# EAGLE design WS2812B-compact_2 (EAGLE 6.6.0)
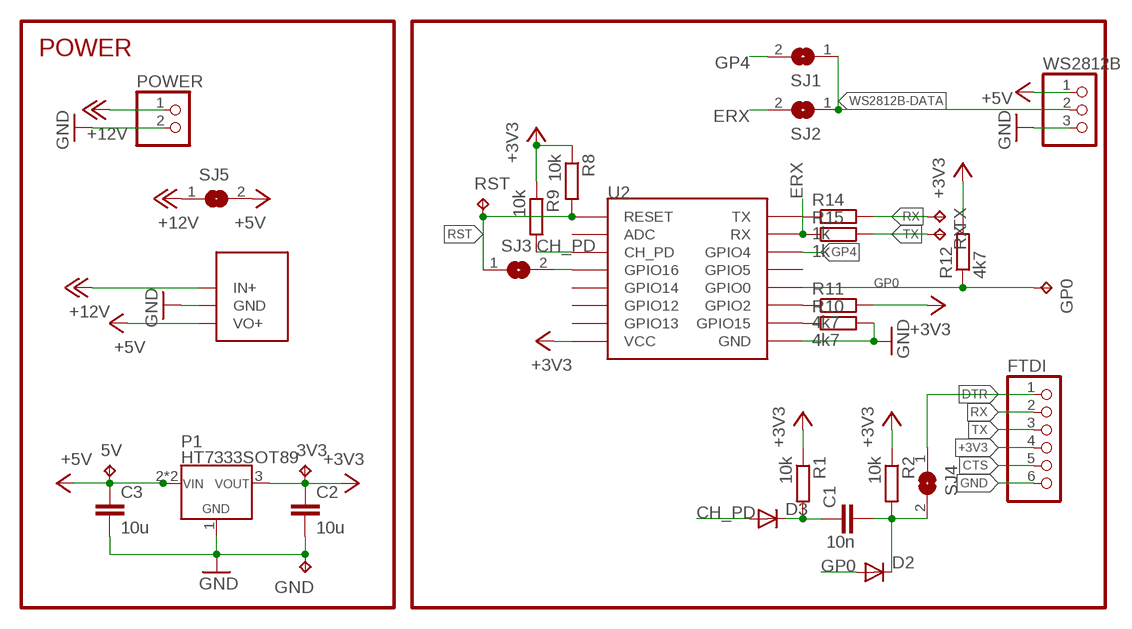
[diagram p0: schematic, sheet 1]

## Parts
3V3  TPB1,27  [B1,27]
5V  TPB1,27  [B1,27]
C1  10n  C-EUC0805  [C0805]
C2  10u  C-EUC0805  [C0805]
C3  10u  C-EUC0805  [C0805]
D2  DIODE-MINIMELF  [MINIMELF]
D3  DIODE-MINIMELF  [MINIMELF]
FTDI  PINHD-1X06_2.54-S  [1X06-S]
GND  TPB1,27  [B1,27]
GP0  TPB1,27  [B1,27]
P1  HT7333SOT89  [SOT89]
POWER  PINHD-1X2  [1X02]
R1  10k  R-EU_R0805  [R0805]
R2  10k  R-EU_R0805  [R0805]
R8  10k  R-EU_R0805  [R0805]
R9  10k  R-EU_R0805  [R0805]
R10  4k7  R-EU_R0805  [R0805]
R11  4k7  R-EU_R0805  [R0805]
R12  4k7  R-EU_R0805  [R0805]
R14  1k  R-EU_R0805  [R0805]
R15  1k  R-EU_R0805  [R0805]
RST  TPB1,27  [B1,27]
RX  TPB1,27  [B1,27]
SJ1  SJ  [SJ]
SJ2  SJ  [SJ]
SJ3  SJ  [SJ]
SJ4  SJ  [SJ]
SJ5  SJ  [SJ]
TX  TPB1,27  [B1,27]
U2  ESP12SMD  [ESP12-SMD]
U$1  BUCK_CONVERTER_TE818_VAR  [BUCK_CONVERTER_TE818_VAR]
WS2812B  PINHD-1X03_2.54-S  [1X03-S]

## Nets
+3V3: 3V3.TP C2.1 FTDI.4 P1.3(VOUT) R1.1 R2.1 R8.1 R9.1 R11.2 R12.2 U2.VCC
+5V: 5V.TP C3.1 P1.2(VIN) P1.2@1(VIN) SJ5.2 U$1.VO+ WS2812B.1
+12V: POWER.1 SJ5.1 U$1.IN+
CH_PD: D3.A R9.2 U2.CH_PD
CTS: FTDI.5
DTR: FTDI.1 SJ4.1
ERX: R15.1 SJ2.2 U2.RXD0(RX)
GND: C2.2 C3.2 FTDI.6 GND.TP P1.1(GND) POWER.2 R10.2 U2.GND U$1.GND WS2812B.3
GP0: D2.A GP0.TP R12.1 U2.GPIO0
GP4: SJ1.2 U2.GPIO4
N$2: C1.2 D2.C R2.2 SJ4.2
N$3: C1.1 D3.C R1.2
N$4: R10.1 U2.GPIO15
N$5: R11.1 U2.GPIO2
N$6: SJ3.2 U2.GPIO16
N$7: R14.1 U2.TXD0(TX)
RST: R8.2 RST.TP SJ3.1 U2.RESET
RX: FTDI.2 R14.2 TX.TP
TX: FTDI.3 R15.2 RX.TP
WS2812B-DATA: SJ1.1 SJ2.1 WS2812B.2
Unconnected: U2.ADC U2.GPIO5 U2.GPIO12 U2.GPIO13 U2.GPIO14

## Notes on the sheet
- POWER

## Library data of the parts
3V3 5V GND GP0 RST RX TX = testpad:TP: Test pad
C1-C3 = rcl:C-EU: CAPACITOR, European symbol
D2 D3 = diode:DIODE-: DIODE
FTDI = pinhead-2:PINHD-1X06: PIN HEADER
P1 = diyHue:HT7333
POWER = pinhead:PINHD-1X2: PIN HEADER
R1 R2 R8-R12 R14 R15 = rcl:R-EU_: RESISTOR, European symbol
SJ1-SJ5 = jumper:SJ: SMD solder JUMPER
U2 = esp8266modules:ESP12: ESP8266 Wifi module 12
U$1 = diyHue:BUCK_CONVERTER_TE818
WS2812B = pinhead-2:PINHD-1X03: PIN HEADER

## Net classes
0 default: clearance 0.127 mm

## Board
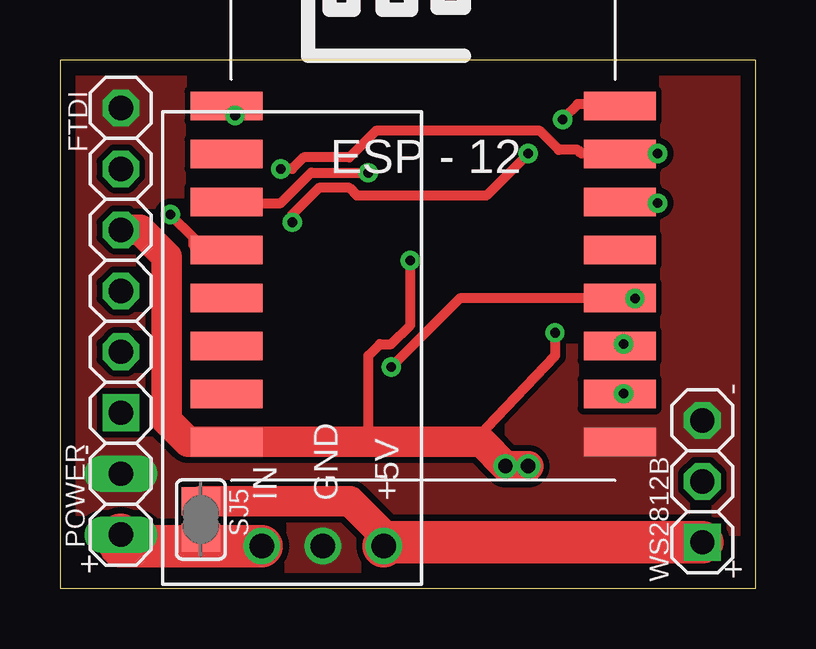
[diagram p1: board, top side]
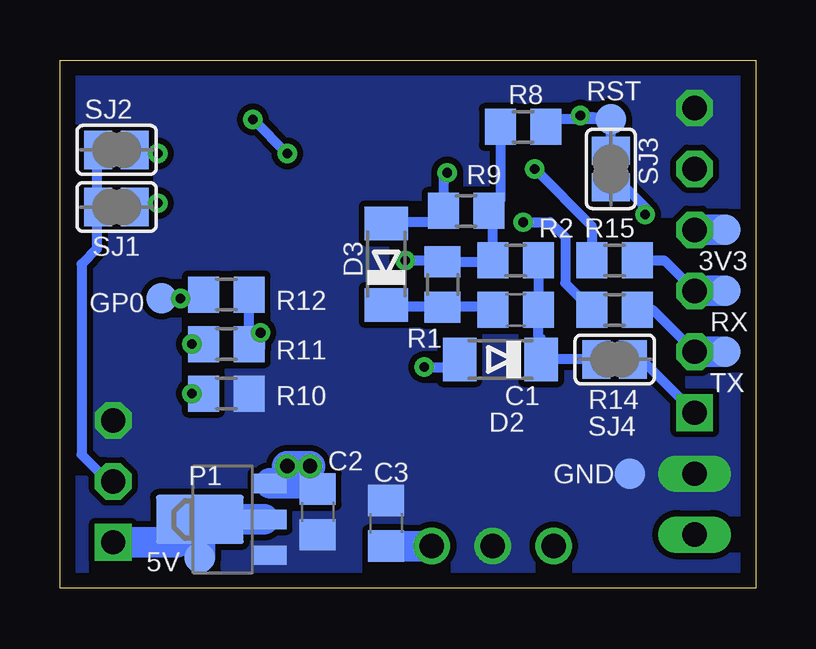
[diagram p2: board, bottom side, seen from below]

Size 29 x 22 mm. Coordinates in mm from the lower left corner, seen from the top.
Outline: 0,0 29,0 29,22 0,22 0,0
Copper layers (1*16): Top 0.035mm / dielectric 1.5mm / Bottom 0.035mm
Design rules "default *": minimum track width 10mil, minimum drill 19mil, track to track 8mil, track to pad 8mil, pad to pad 8mil, via to via 8mil, smd to smd 0mil, copper to edge 25mil, drill to drill 8mil, minimum pad ring 10mil, minimum via ring 8mil, stop-mask expansion 4mil, vias tented up to drill 50mil, thermal gap 10mil

### Footprints (pad centres in the part's own frame; a part is rotated, then mirrored left to right if it is on the bottom)
B1,27 = smd 1.27 x 1.27: TP 0,0
C0805 = smd 1.3 x 1.5: 1 -0.95,0; 2 0.95,0
MINIMELF = smd 1.4 x 1.8: A 1.7,0; C -1.7,0
1X06-S = drill 1.016 square: 1 -6.35,0 | drill 1.016 octagon: 2 -3.81,0; 3 -1.27,0; 4 1.27,0; 5 3.81,0; 6 6.35,0
SOT89 = smd 0.8 x 1.4: 1 -1.499,-1.981; 3 1.499,-1.981 | smd 0.8 x 1.9: 2 0,-1.727 | smd 2.032 x 3.65: 2@1 0,0.94
1X02 = drill 1.016 long: 1 -1.27,0; 2 1.27,0
R0805 = smd 1.3 x 1.5: 1 -0.95,0; 2 0.95,0
SJ = smd 1.168 x 1.6: 1 -0.762,0; 2 0.762,0
ESP12-SMD = smd 3 x 1.2: ADC -8.3,3.8; CH_PD -8.3,1.8; GND 8.1,-8.2; GPIO0 8.1,-2.2; GPIO2 8.1,-4.2; GPIO4 8.1,1.8; GPIO5 8.1,-0.2; GPIO12 -8.3,-4.2; GPIO13 -8.3,-6.2; GPIO14 -8.3,-2.2; GPIO15 8.1,-6.2; GPIO16 -8.3,-0.2; RESET -8.3,5.8; RXD0 8.1,3.8; TXD0 8.1,5.8; VCC -8.3,-8.2
BUCK_CONVERTER_TE818_VAR = drill 1.016: GND 0,-1.27; IN+ 0,1.27; VO+ 0,-3.81
1X03-S = drill 1.016 square: 1 -2.54,0 | drill 1.016 octagon: 2 0,0; 3 2.54,0

### Placement (x,y rotation side)
3V3  1.27,14.92 180 bottom
5V  23.18,1.27 0 bottom
C1  10,11.59 0 bottom
C2  18.26,3.17 270 bottom
C3  15.4,2.7 90 bottom
D2  10.64,9.53 180 bottom
D3  15.4,13.49 90 bottom
FTDI  2.54,13.65 90 top
GND  5.24,4.76 180 bottom
GP0  24.77,12.06 0 bottom
P1  22.23,2.86 90 bottom
POWER  2.54,3.49 90 top
R1  13.05,12.65 270 bottom
R2  10,13.65 0 bottom
R8  9.68,19.21 0 bottom
R9  12.06,15.72 180 bottom
R10  22.07,8.1 0 bottom
R11  22.07,10.16 0 bottom
R12  22.07,12.22 0 bottom
R14  5.87,11.59 0 bottom
R15  5.87,13.65 0 bottom
RST  6.03,19.53 180 bottom
RX  1.27,12.38 0 bottom
SJ1  26.64,15.88 0 bottom
SJ2  26.64,18.26 0 bottom
SJ3  6.03,17.46 270 bottom
SJ4  5.87,9.53 180 bottom
SJ5  5.87,2.86 90 top
TX  1.27,9.84 180 bottom
U2  15.24,14.29 0 top
U$1  9.68,1.75 90 top
WS2812B  26.78,4.45 90 top

### Tracks (layer width: path | path; a pad name or v marks a point on that pad's centre or on a via)
+3V3  (via drill 0.4, 0.6)
  Top 0.406: 7.46,6.03 U2.VCC | v20.64,10.64 20.64,9.68 17.78,6.67 17.57,6.09 | v14.61,13.65 14.61,10.95 13.81,10.16 13.34,10.16 12.86,9.68 12.86,6.09
  Top 1.27: FTDI.4 3.33,14.92 4.45,13.81 4.45,6.99 5.34,6.09 U2.VCC 12.86,6.09 17.57,6.09 v18.57,5.08 v19.53,5.08
  Bottom 0.406: R8.1 10.63,16.2 R9.1 10.95,15.55 R2.1 11.01,13.6 R1.1 | R12.2 R11.2 20.64,10 | 13.18,13.65 R1.1 | 20.64,10 v20.64,10.64 | 20.64,10 21.11,9.68 | v14.61,13.65 13.34,13.65 R1.1
  Bottom 1.27: 3V3.TP FTDI.4 | P1.3 19.53,4.36 | 19.53,4.36 18.49,4.36 C2.1 | v19.53,5.08 v18.57,5.08 19.53,4.36
+5V
  Top 1.27: U$1.VO+ 13.49,2.22 12.1,3.62 SJ5.2
  Top 1.778: WS2812B.1 13.65,1.91 U$1.VO+
  Bottom 1.27: P1.2 P1.2@1 | P1.2@1 23.16,1.28 5V.TP | U$1.VO+ C3.1 | WS2812B.1 24.12,1.91 P1.2@1
+12V
  Top 1.27: SJ5.1 5.87,1.78 6.03,1.75
  Top 1.778: U$1.IN+ 6.03,1.75 2.54,1.75 POWER.1
CH_PD  (via drill 0.4)
  Top 0.406: v12.86,17.3 10.48,17.3 9.21,16.03 6.99,16.03 U2.CH_PD
  Bottom 0.406: D3.A 15.4,15.24 13.02,15.24 R9.2 13.02,15.88 13.02,17.14 v12.86,17.3
DTR
  Bottom 0.406: SJ4.1 4.76,9.53 FTDI.1
ERX  (via drill 0.4)
  Top 0.406: v24.92,18.1 23.5,18.1 U2.RXD0 23.18,18.1 21.75,18.1 21.59,18.26 20.8,18.26 20,19.05 13.18,19.05 12.06,17.94 10.16,17.94 9.68,17.46 v9.21,17.46
  Bottom 0.406: v24.92,18.1 25.88,18.1 SJ2.2 | v9.21,17.46 6.83,15.08 R15.1
GND
  pour Bottom (isolate 0.254, no thermals): -4.45,26.67 31.27,26.67 31.27,-2.54 -4.45,-2.54
  pour Top (isolate 0.254, no thermals): -9.53,26.99 30.32,26.99 30.32,-2.22 -9.53,-2.22
GP0  (via drill 0.4)
  Top 0.406: v23.97,12.06 23.5,12.06 U2.GPIO0 23.18,12.06 16.67,12.06 v13.81,9.21
  Bottom 0.406: GP0.TP v23.97,12.06 23.02,12.06 R12.1 | v13.81,9.21 12.38,9.21 12.38,9.53 D2.A
GP4  (via drill 0.4)
  Top 0.406: 25.08,16.03 v24.92,16.03 23.5,16.03 U2.GPIO4
  Bottom 0.406: v24.92,16.03 25.88,16.03 SJ1.2
N$2
  Bottom 0.406: 8.89,9.53 8.89,10.32 9.05,10.48 C1.2 9.05,11.75 R2.2 | 8.89,9.53 D2.C 8.89,9.37 8.89,9.53 | SJ4.2 8.89,9.53
N$3
  Bottom 0.406: C1.1 11.27,11.59 11.43,11.75 13.02,11.75 R1.2 13.18,11.75 15.4,11.75 D3.C
N$4  (via drill 0.4)
  Top 0.406: v23.5,8.1 U2.GPIO15
  Bottom 0.406: v23.5,8.1 23.18,8.1 23.02,8.26 22.86,8.1 R10.1
N$5  (via drill 0.4)
  Top 0.406: v23.5,10.16 U2.GPIO2
  Bottom 0.406: v23.5,10.16 R11.1
N$6  (via drill 0.4)
  Top 0.406: v4.6,15.56 5.56,14.61 5.56,14.29 5.71,14.13 6.83,14.13 U2.GPIO16
  Bottom 0.406: v4.6,15.56 4.6,15.88 5.71,16.99 6.03,16.99 SJ3.2
N$7  (via drill 0.4)
  Top 0.406: v9.68,15.24 9.68,15.56 10.79,16.67 12.06,16.67 12.38,16.35 17.78,16.35 v19.53,18.1 | v20.95,19.53 21.59,20.16 23.34,20.16 U2.TXD0
  Bottom 0.406: v9.68,15.24 8.57,15.24 7.94,14.61 7.94,12.7 7.3,12.06 6.83,12.06 R14.1 | v20.95,19.53 v19.53,18.1
RST  (via drill 0.4)
  Top 0.406: v7.3,19.68 6.83,20.16 U2.RESET
  Bottom 0.406: RST.TP 8.57,19.53 R8.2 | SJ3.1 RST.TP | RST.TP v7.3,19.68
RX
  Bottom 0.406: R14.2 4.29,11.59 FTDI.2
  Bottom 1.27: TX.TP FTDI.2
TX
  Bottom 0.406: R15.2 3.81,13.65 FTDI.3
  Bottom 1.27: RX.TP FTDI.3
WS2812B-DATA
  Bottom 0.406: WS2812B.2 26.99,4.45 28.1,5.56 28.1,13.49 27.46,14.13 27.46,15.88 SJ1.1 27.46,16.03 27.46,18.26 SJ2.1

### Text on the board
tPlace: - | - | + | +